# EAGLE design Röhren (EAGLE 6.1)
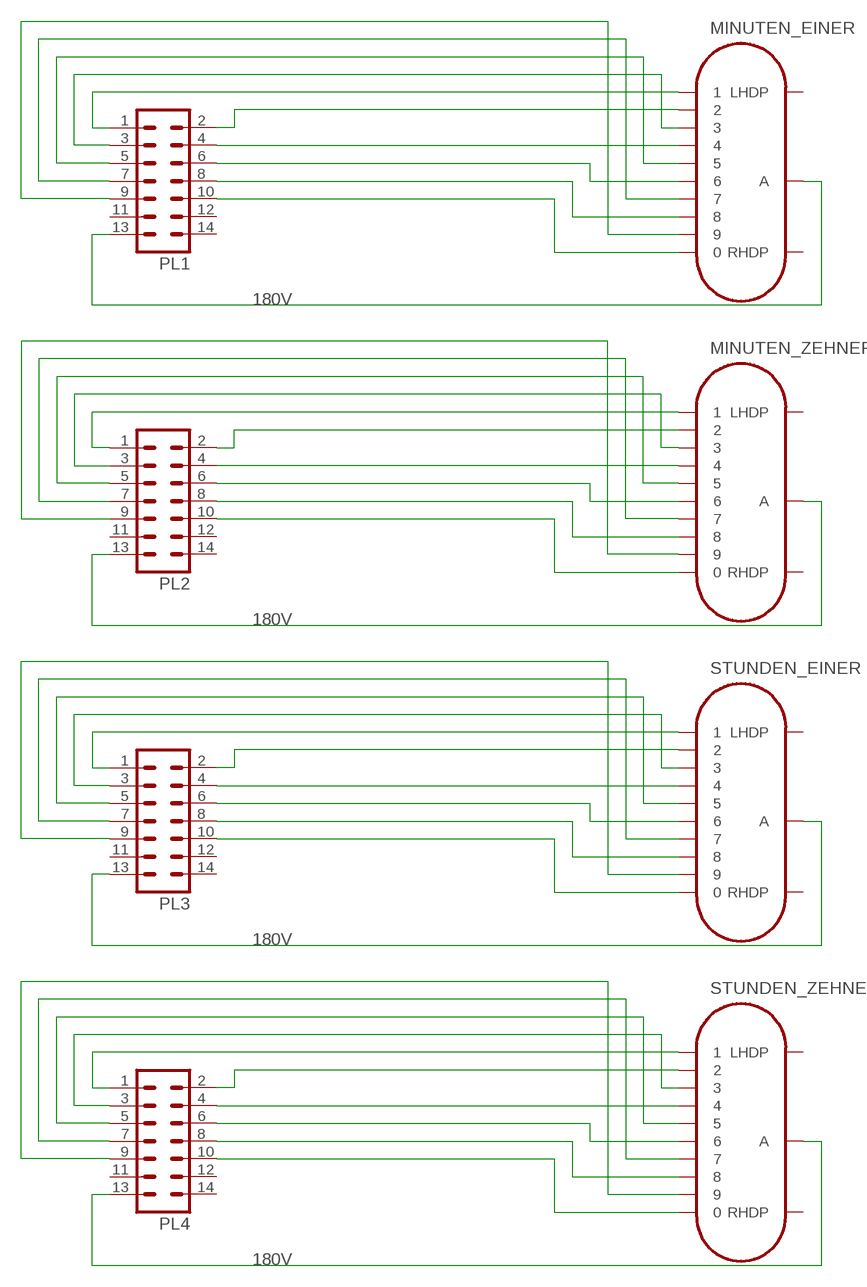
[diagram p0: schematic, sheet 1]

## Parts
MINUTEN_EINER  IN-16  [IN-16]
MINUTEN_ZEHNER  IN-16  [IN-16]
PL1  ML14  [ML14]
PL2  ML14  [ML14]
PL3  ML14  [ML14]
PL4  ML14  [ML14]
STUNDEN_EINER  IN-16  [IN-16]
STUNDEN_ZEHNER  IN-16  [IN-16]

## Nets
N$1: MINUTEN_EINER.1 PL1.1
N$2: MINUTEN_ZEHNER.1 PL2.1
N$3: PL3.1 STUNDEN_EINER.1
N$4: PL3.2 STUNDEN_EINER.2
N$5: MINUTEN_EINER.2 PL1.2
N$6: MINUTEN_EINER.3 PL1.3
N$7: MINUTEN_EINER.4 PL1.4
N$8: MINUTEN_EINER.5 PL1.5
N$9: MINUTEN_EINER.6 PL1.6
N$11: MINUTEN_EINER.8 PL1.8
N$12: MINUTEN_EINER.9 PL1.9
N$13: MINUTEN_EINER.0 PL1.10
N$14: MINUTEN_EINER.A PL1.13
N$15: MINUTEN_ZEHNER.6 PL2.6
N$16: MINUTEN_ZEHNER.2 PL2.2
N$17: MINUTEN_ZEHNER.3 PL2.3
N$18: MINUTEN_ZEHNER.4 PL2.4
N$19: MINUTEN_ZEHNER.5 PL2.5
N$20: MINUTEN_ZEHNER.7 PL2.7
N$21: MINUTEN_ZEHNER.8 PL2.8
N$22: MINUTEN_ZEHNER.9 PL2.9
N$23: MINUTEN_ZEHNER.0 PL2.10
N$24: MINUTEN_ZEHNER.A PL2.13
N$25: PL3.3 STUNDEN_EINER.3
N$26: PL3.4 STUNDEN_EINER.4
N$27: PL3.5 STUNDEN_EINER.5
N$28: PL3.6 STUNDEN_EINER.6
N$29: PL3.7 STUNDEN_EINER.7
N$30: PL3.8 STUNDEN_EINER.8
N$31: PL3.9 STUNDEN_EINER.9
N$32: PL3.10 STUNDEN_EINER.0
N$33: PL3.13 STUNDEN_EINER.A
N$34: PL4.1 STUNDEN_ZEHNER.1
N$35: PL4.2 STUNDEN_ZEHNER.2
N$36: PL4.3 STUNDEN_ZEHNER.3
N$37: PL4.4 STUNDEN_ZEHNER.4
N$38: PL4.5 STUNDEN_ZEHNER.5
N$39: PL4.6 STUNDEN_ZEHNER.6
N$40: PL4.7 STUNDEN_ZEHNER.7
N$41: PL4.8 STUNDEN_ZEHNER.8
N$42: PL4.9 STUNDEN_ZEHNER.9
N$43: PL4.10 STUNDEN_ZEHNER.0
N$44: PL4.13 STUNDEN_ZEHNER.A
STUNDEN_ZEHNER: MINUTEN_EINER.7 PL1.7
Unconnected: MINUTEN_EINER.LHDP MINUTEN_EINER.RHDP MINUTEN_ZEHNER.LHDP MINUTEN_ZEHNER.RHDP PL1.11 PL1.12 PL1.14 PL2.11 PL2.12 PL2.14 PL3.11 PL3.12 PL3.14 PL4.11 PL4.12 PL4.14 STUNDEN_EINER.LHDP STUNDEN_EINER.RHDP STUNDEN_ZEHNER.LHDP STUNDEN_ZEHNER.RHDP

## Notes on the sheet
- 180V
- 180V
- 180V
- 180V

## Library data of the parts
MINUTEN_EINER MINUTEN_ZEHNER STUNDEN_EINER STUNDEN_ZEHNER = russian-nixies:IN-16: IN-16: small numeric frontview nixie tube
PL1-PL4 = con-harting-ml:ML14: HARTING; OC_FARNELL: unknown; OC_NEWARK: unknown

## Board
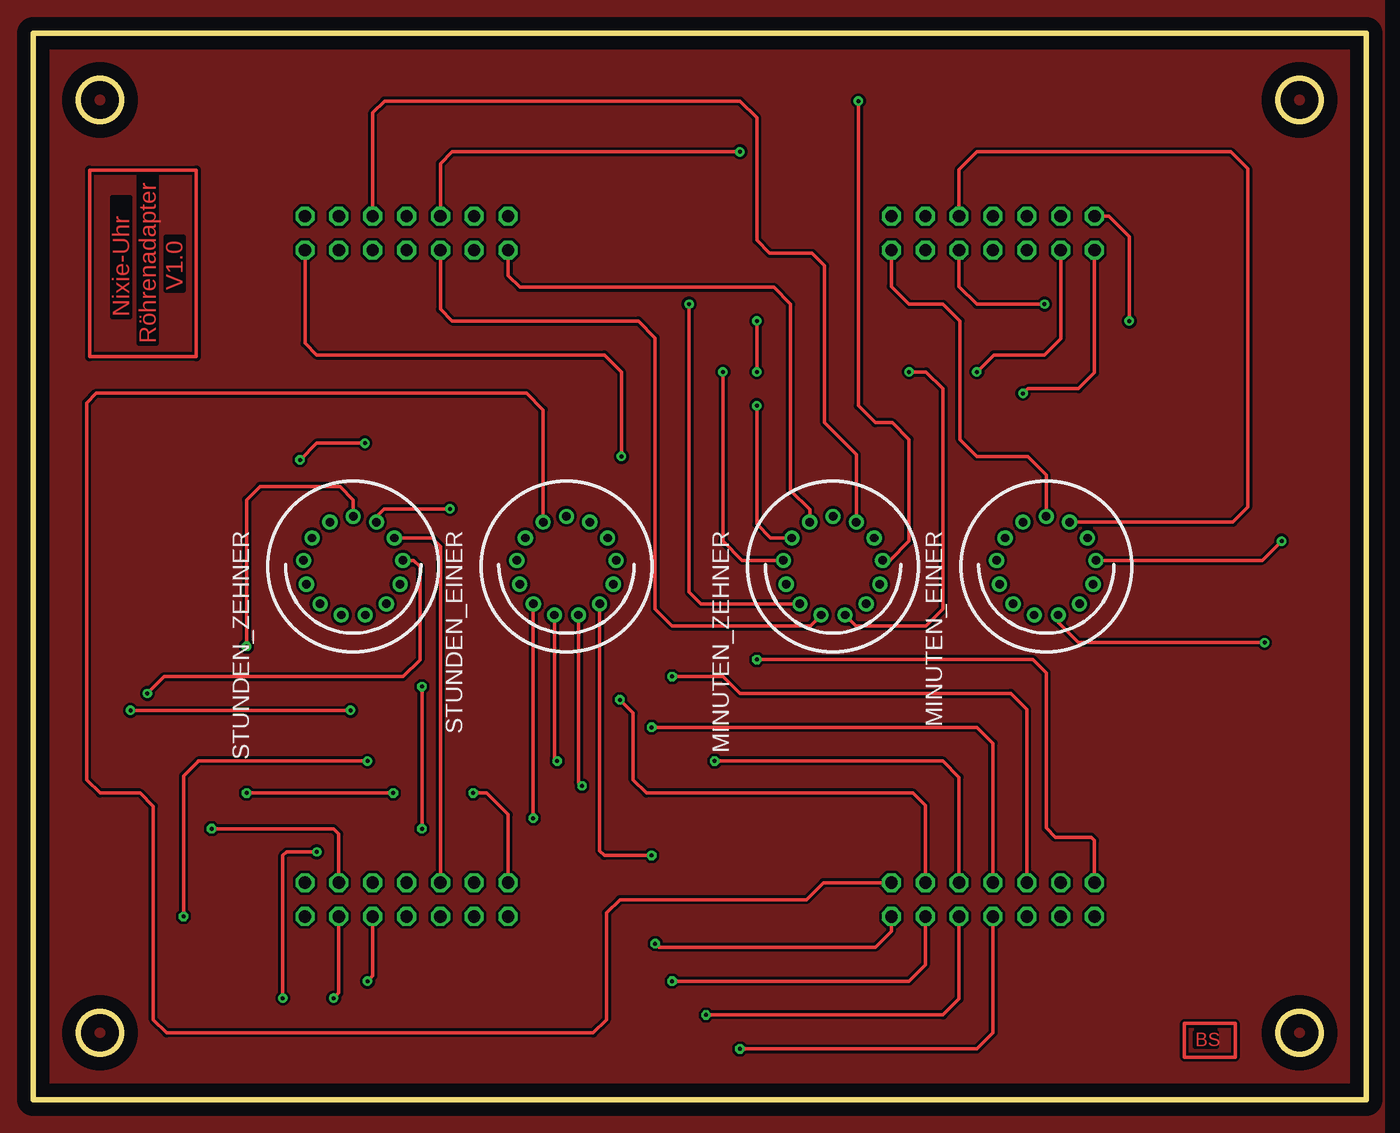
[diagram p1: board, top side]
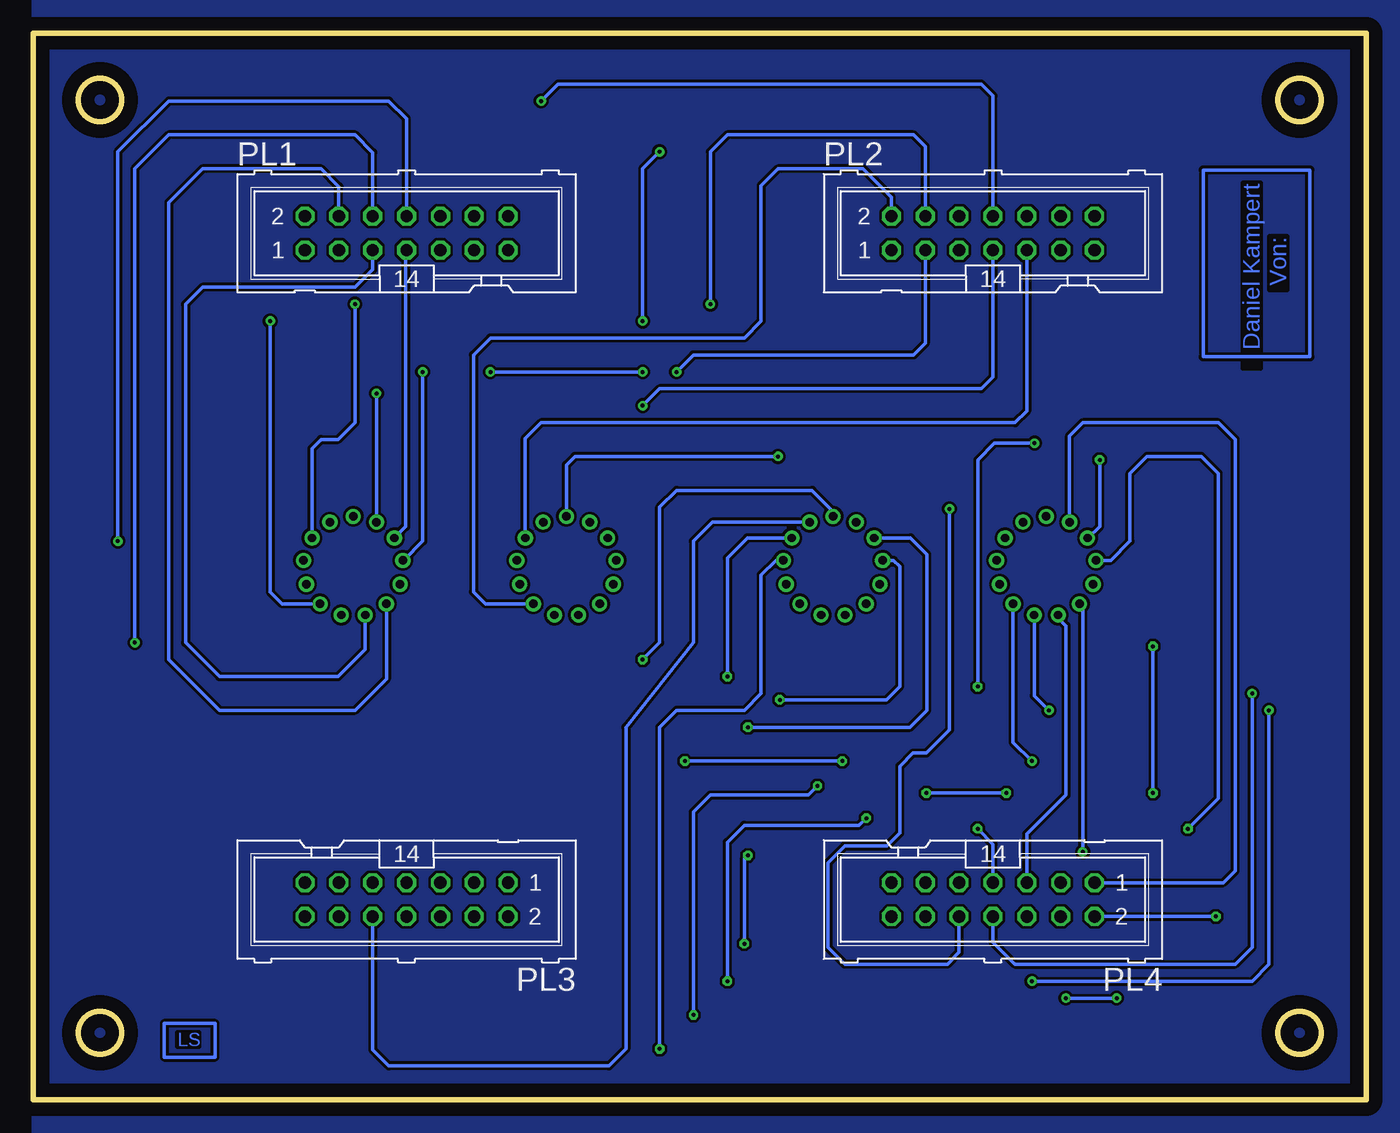
[diagram p2: board, bottom side, seen from below]

Size 100 x 80.01 mm. Coordinates in mm from the lower left corner, seen from the top.
Outline: 100,0.01 100,80.01 0,80.01 0,0 100,0
Outline: circle at 95,75.01 radius 1.6
Outline: circle at 95,5.01 radius 1.6
Outline: circle at 5,75.01 radius 1.6
Outline: circle at 5,5.01 radius 1.6
Copper layers (1*16): Top 0.035mm / dielectric 1.5mm / Bottom 0.035mm
Design rules: minimum track width 10mil, minimum drill 24mil, track to track 8mil, track to pad 8mil, pad to pad 8mil, via to via 8mil, smd to smd 8mil, copper to edge 40mil, drill to drill 8mil, minimum pad ring 10mil, minimum via ring 8mil, stop-mask expansion 4mil, vias tented up to drill 0mil, thermal gap 10mil

### Footprints (pad centres in the part's own frame; a part is rotated, then mirrored left to right if it is on the bottom)
IN-16 = drill 0.63: 0 -1.745,-3.325; 1 1.745,-3.325; 2 -2.49,2.81; 3 3.727,-0.453; 4 2.49,2.81; 5 0.898,3.645; 6 -0.898,3.645; 7 3.09,-2.133; 8 -3.727,-0.453; 9 -3.09,-2.133; A 0,-3.755; LHDP -3.511,1.331; RHDP 3.511,1.331
ML14 = drill 0.914 octagon: 1 -7.62,-1.27; 2 -7.62,1.27; 3 -5.08,-1.27; 4 -5.08,1.27; 5 -2.54,-1.27; 6 -2.54,1.27; 7 0,-1.27; 8 0,1.27; 9 2.54,-1.27; 10 2.54,1.27; 11 5.08,-1.27; 12 5.08,1.27; 13 7.62,-1.27; 14 7.62,1.27

### Placement (x,y rotation side)
MINUTEN_EINER  76,40.01 180 top
MINUTEN_ZEHNER  60,40.01 180 top
PL1  72,65.01 0 bottom
PL2  28,65.01 0 bottom
PL3  72,15.01 180 bottom
PL4  28,15.01 180 bottom
STUNDEN_EINER  40,40.01 180 top
STUNDEN_ZEHNER  24,40.01 180 top

### Tracks (layer width: path | path; a pad name or v marks a point on that pad's centre or on a via)
N$1  (via drill 0.3)
  Top 0.254: PL1.1 79.62,54.55 78.41,53.34 74.6,53.34 v74.25,52.99
  Bottom 0.254: MINUTEN_EINER.1 v74.25,52.99
N$2
  Top 0.254: PL2.1 35.62,61.84 36.5,60.96 55.55,60.96 56.82,59.69 56.82,45.72 58.26,44.28 MINUTEN_ZEHNER.1
N$3
  Top 0.254: PL3.1 59.27,16.28 58,15.01 44,15.01 43,14.01 43,6.01 42,5.01 10,5.01 9,6.01 9,22.01 8,23.01 5,23.01 4,24.01 4,52.28 4.73,53.01 37,53.01 38.26,51.75 STUNDEN_EINER.1
N$4  (via drill 0.3)
  Top 0.254: PL3.2 64.38,12.64 63.17,11.43 46.93,11.43 v46.66,11.7 | v46.39,18.32 42.85,18.32 42.49,18.68 STUNDEN_EINER.2
  Bottom 0.254: v46.66,11.7 46.66,18.05 v46.39,18.32
N$5  (via drill 0.3)
  Top 0.254: PL1.2 80.71,66.28 82.22,64.77 v82.22,58.42
  Bottom 0.254: v82.22,58.42 82.22,38.1 81.32,37.2 MINUTEN_EINER.2
N$6  (via drill 0.3)
  Top 0.254: PL1.3 77.08,57.09 75.87,55.88 72.06,55.88 v70.79,54.61
  Bottom 0.254: v70.79,54.61 70.79,41.91 72.24,40.46 MINUTEN_EINER.3
N$7
  Bottom 0.254: PL1.4 77.08,68.52 78.41,69.85 87.3,69.85 89.84,67.31 89.84,33.02 86.03,29.21 75.87,29.21 73.51,31.57 MINUTEN_EINER.4
N$8
  Bottom 0.254: PL1.5 74.54,62.29 75.87,60.96 87.3,60.96 88.57,59.69 88.57,34.29 86.03,31.75 77.14,31.75 75.1,33.79 MINUTEN_EINER.5
N$9  (via drill 0.3)
  Top 0.254: v92.38,34.29 78.41,34.29 76.9,35.8 MINUTEN_EINER.6
  Bottom 0.254: PL1.6 74.54,71.06 75.87,72.39 89.84,72.39 92.38,69.85 v92.38,34.29
N$10
  pour Top: 101.27,-8.89 101.27,82.55 -7.95,82.55 -7.95,-8.89
N$11  (via drill 0.3)
  Top 0.254: v93.65,41.91 92.2,40.46 MINUTEN_EINER.8
  Bottom 0.254: PL1.8 72,73.6 73.33,74.93 89.84,74.93 93.65,71.12 v93.65,41.91
N$12  (via drill 0.3)
  Top 0.254: PL1.9 69.46,61.02 70.79,59.69 v75.87,59.69
  Bottom 0.254: v75.87,59.69 75.87,50.8 77.14,49.53 78.41,49.53 79.09,48.85 MINUTEN_EINER.9
N$13
  Top 0.254: PL1.10 69.46,69.79 70.79,71.12 89.84,71.12 91.11,69.85 91.11,44.45 90,43.34 MINUTEN_EINER.0
N$14
  Top 0.254: MINUTEN_EINER.A 76,46.86 74.6,48.26 70.79,48.26 69.52,49.53 69.52,58.42 68.25,59.69 65.71,59.69 64.38,61.02 PL1.13
N$15  (via drill 0.3)
  Top 0.254: PL2.6 30.54,70.24 31.42,71.12 v53.01,71.12 | MINUTEN_ZEHNER.6 61.7,35.56 66.98,35.56 68.25,36.83 68.25,53.34 66.98,54.61 v65.71,54.61 | v54.28,58.42 v54.28,54.61
  Bottom 0.254: v53.01,71.12 54.28,69.85 v54.28,58.42 | v54.28,54.61 v65.71,54.61
N$16
  Bottom 0.254: PL2.2 35.62,67.7 37.77,69.85 44.12,69.85 45.39,68.58 45.39,58.42 46.66,57.15 65.71,57.15 66.98,55.88 66.98,38.1 66.08,37.2 MINUTEN_ZEHNER.2
N$17  (via drill 0.3)
  Top 0.254: v51.74,54.61 51.74,41.91 53.19,40.46 MINUTEN_ZEHNER.3
  Bottom 0.254: PL2.3 33.08,56.76 33.96,55.88 50.47,55.88 v51.74,54.61
N$18  (via drill 0.3)
  Top 0.254: v49.2,59.69 49.2,38.1 50.1,37.2 MINUTEN_ZEHNER.4
  Bottom 0.254: PL2.4 33.08,71.51 33.96,72.39 47.93,72.39 49.2,71.12 v49.2,59.69
N$19
  Top 0.254: PL2.5 30.54,59.3 31.42,58.42 45.39,58.42 46.66,57.15 46.66,36.83 47.93,35.56 58.3,35.56 MINUTEN_ZEHNER.5
N$20  (via drill 0.3)
  Top 0.254: v54.28,52.07 54.28,43.18 55.32,42.14 MINUTEN_ZEHNER.7
  Bottom 0.254: PL2.7 28,54.22 28.88,53.34 53.01,53.34 v54.28,52.07
N$21  (via drill 0.3)
  Top 0.254: v61.9,74.93 61.9,52.07 63.17,50.8 64.44,50.8 65.71,49.53 65.71,41.91 64.26,40.46 MINUTEN_ZEHNER.8
  Bottom 0.254: PL2.8 28,75.32 28.88,76.2 60.63,76.2 v61.9,74.93
N$22
  Bottom 0.254: PL2.9 25.46,51.68 26.34,50.8 61.9,50.8 63.09,49.61 MINUTEN_ZEHNER.9
N$23
  Top 0.254: MINUTEN_ZEHNER.0 61.74,48.41 59.36,50.8 59.36,62.57 58.42,63.51 55.24,63.51 54.28,64.48 54.28,73.66 53.01,74.93 26.34,74.93 25.46,74.05 PL2.10
N$24  (via drill 0.3)
  Top 0.254: PL2.13 20.38,56.76 21.26,55.88 42.85,55.88 44.12,54.61 v44.12,48.26
  Bottom 0.254: v44.12,48.26 59.36,48.26 60,47.62 MINUTEN_ZEHNER.A
N$25  (via drill 0.3)
  Top 0.254: PL3.3 66.92,22.09 66,23.01 46,23.01 45,24.01 45,29.01 v44,30.01
  Bottom 0.254: v44,30.01 36,30.01 35,31.01 35,40.01 35.45,40.46 STUNDEN_EINER.3
N$26  (via drill 0.3)
  Top 0.254: PL3.4 66.92,10.1 65.71,8.89 v47.93,8.89 | STUNDEN_EINER.4 v37.51,21.12
  Bottom 0.254: v47.93,8.89 47.93,19.32 46.66,20.59 38.04,20.59 v37.51,21.12
N$27  (via drill 0.3)
  Top 0.254: PL3.5 69.46,24.19 68.25,25.4 v51.12,25.4 | STUNDEN_EINER.5 39.1,25.61 v39.31,25.4
  Bottom 0.254: v51.12,25.4 v39.31,25.4
N$28  (via drill 0.3)
  Top 0.254: PL3.6 69.46,7.56 68.25,6.35 v50.47,6.35 | STUNDEN_EINER.6 40.9,23.81 v41.17,23.54
  Bottom 0.254: v50.47,6.35 50.47,21.59 49.2,22.86 41.85,22.86 v41.17,23.54
N$29  (via drill 0.3)
  Top 0.254: PL3.7 72,26.73 70.79,27.94 v46.39,27.94
  Bottom 0.254: v46.39,27.94 34.23,27.94 32.96,29.21 32.96,40.91 34.19,42.14 STUNDEN_EINER.7
N$30  (via drill 0.3)
  Top 0.254: v53.01,3.81 70.79,3.81 72,5.02 PL3.8
  Bottom 0.254: STUNDEN_EINER.8 44.3,40.46 45.39,39.37 45.39,30.48 46.66,29.21 51.74,29.21 53.01,27.94 v53.01,3.81
N$31  (via drill 0.3)
  Top 0.254: v47.93,31.75 51.74,31.75 53.01,30.48 73.33,30.48 74.54,29.27 PL3.9
  Bottom 0.254: STUNDEN_EINER.9 46.43,42.14 47.93,40.64 v47.93,31.75
N$32
  Bottom 0.254: STUNDEN_EINER.0 49.05,43.34 50.47,41.91 50.47,34.29 55.55,27.94 55.55,3.81 56.82,2.54 73.33,2.54 74.54,3.75 PL3.10
N$33  (via drill 0.3)
  Top 0.254: v54.28,33.02 75,33.02 76,32.02 76,20.38 76.68,19.7 79.38,19.7 79.62,19.45 PL3.13
  Bottom 0.254: v54.28,33.02 53.01,34.29 53.01,44.45 51.74,45.72 41.58,45.72 40,44.14 STUNDEN_EINER.A
N$34
  Bottom 0.254: STUNDEN_ZEHNER.1 22.25,49.8 21.26,50.8 11.1,50.8 9.83,49.53 9.83,17.18 10.73,16.28 PL4.1
N$35  (via drill 0.3)
  Top 0.254: v25.07,25.4 12.37,25.4 12.37,25.38 11.27,24.28 v11.27,13.74
  Bottom 0.254: STUNDEN_ZEHNER.2 26.49,26.82 v25.07,25.4 | PL4.2 v11.27,13.74
N$36  (via drill 0.3)
  Top 0.254: PL4.3 22.92,19.93 22.53,20.32 v13.37,20.32
  Bottom 0.254: v13.37,20.32 11.1,22.59 11.1,46.99 12.37,48.26 16.45,48.26 17.72,46.99 17.72,41.91 19.17,40.46 STUNDEN_ZEHNER.3
N$37  (via drill 0.3)
  Top 0.254: PL4.4 22.92,8.01 v22.53,7.62 | v18.72,7.62 18.72,18.32 18.99,18.59 v21.26,18.59
  Bottom 0.254: v22.53,7.62 v18.72,7.62 | v21.26,18.59 21.26,36.95 STUNDEN_ZEHNER.4
N$38
  Bottom 0.254: PL4.5 25.46,19.93 22.53,22.86 22.53,35.56 23.1,36.13 STUNDEN_ZEHNER.5
N$39  (via drill 0.3)
  Top 0.254: PL4.6 25.46,9.28 v25.07,8.89 | v7.29,29.21 v23.8,29.21
  Bottom 0.254: v25.07,8.89 8.56,8.89 7.29,10.16 v7.29,29.21 | STUNDEN_ZEHNER.6 24.9,30.31 v23.8,29.21
N$40  (via drill 0.3)
  Top 0.254: v29.15,20.32 v29.15,30.99 | v24.88,49.26 21.25,49.26 v20,48.01
  Bottom 0.254: PL4.7 28,19.17 v29.15,20.32 | v24.88,49.26 27.88,49.26 29.15,47.99 v29.15,30.99 | STUNDEN_ZEHNER.7 20.87,42.14 20,43.01 v20,48.01
N$41  (via drill 0.3)
  Top 0.254: v8.56,30.48 9.83,31.75 27.74,31.75 29,33.01 29,40.01 28.55,40.46 STUNDEN_ZEHNER.8
  Bottom 0.254: PL4.8 28,11.82 26.34,10.16 9.83,10.16 8.56,11.43 v8.56,30.48
N$42
  Top 0.254: PL4.9 30.54,41.52 29.92,42.14 STUNDEN_ZEHNER.9
N$43  (via drill 0.3)
  Top 0.254: v31.27,44.34 26.32,44.34 25.75,43.75 STUNDEN_ZEHNER.0
  Bottom 0.254: PL4.10 30.54,11.04 31.42,10.16 39.12,10.16 40.39,11.43 40.39,17.78 39.12,19.05 35.96,19.05 35,20.01 35,25.01 34,26.01 33,26.01 31.27,27.75 v31.27,44.34
N$44  (via drill 0.3)
  Top 0.254: STUNDEN_ZEHNER.A 24,45.01 23,46.01 17,46.01 16,45.01 v16,34.01 | v16,23.01 v27,23.01 | v33,23.01 34,23.01 35.62,21.39 PL4.13
  Bottom 0.254: v16,34.01 v16,23.01 | v27,23.01 v33,23.01
N$45
  pour Bottom: 100,-12.7 100,86.36 -6.68,86.36 -6.68,-12.7
N$46
  Bottom 0.254: 86.36,5.72 90.17,5.72 90.17,3.18 86.36,3.18 86.36,5.72
N$47
  pour Top: 4.23,55.75 4.23,69.75 12.23,69.75 12.23,55.75
N$48
  Top 0.254: 4.23,55.75 4.23,69.75 12.23,69.75 12.23,55.75 4.23,55.75
N$49
  Bottom 0.254: 4.23,55.75 4.23,69.75 12.23,69.75 12.23,55.75 4.23,55.75
N$50
  Top 0.254: 86.36,5.72 90.17,5.72 90.17,3.18 86.36,3.18 86.36,5.72
STUNDEN_ZEHNER
  Bottom 0.254: PL1.7 72,63.56 72.06,63.5 72.06,42.99 MINUTEN_EINER.7

### Text on the board
Top: V1.0 | Nixie-Uhr | Röhrenadapter | BS
Bottom: Daniel Kampert | Von: | LS